# EAGLE schematic Pinscape Pico Expansion Board - DIY Friendly Power - SMD Sockets (EAGLE 7.7.0)

## Sheet 1 of 5: Picos
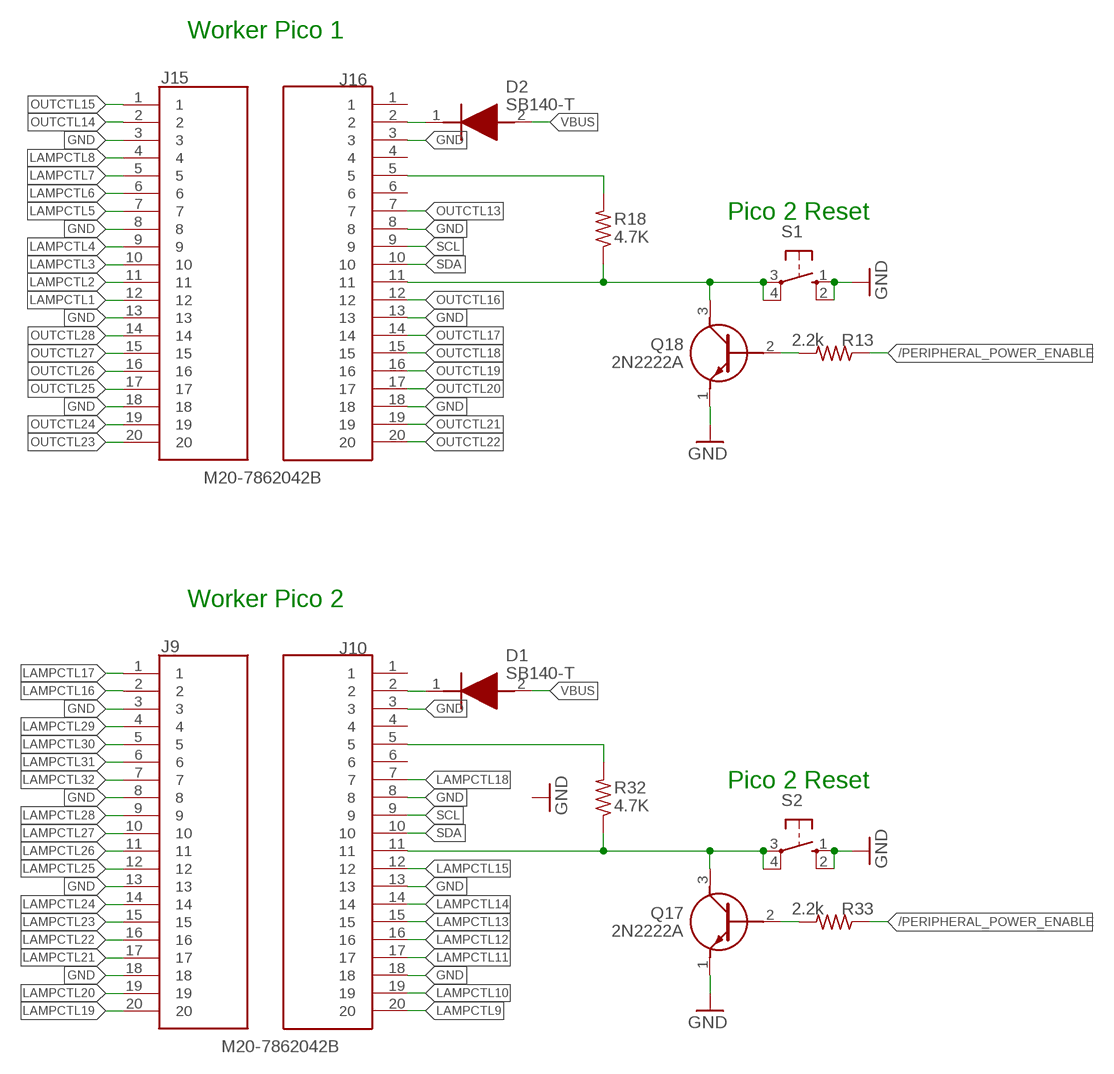
[diagram p0: schematic, sheet 1]

### Parts
D1  SB140-T  [DIOAD1408W86L464D236]
D2  SB140-T  [DIOAD1408W86L464D236]
J9  M20-7862042B  [M20-7862042-B]
J10  M20-7862042B  [M20-7862042-B]
J15  M20-7862042B  [M20-7862042-B]
J16  M20-7862042B  [M20-7862042-B]
Q17  2N2222A  [2N2222A]
Q18  2N2222A  [2N2222A]
R13  2.2k  R-US_0204/7  [0204/7]
R18  4.7K  R-US_0204/7  [0204/7]
R32  4.7K  R-US_0204/7  [0204/7]
R33  2.2k  R-US_0204/7  [0204/7]
S1  10-XX  [B3F-10XX]
S2  10-XX  [B3F-10XX]

### Nets
/PERIPHERAL_POWER_ENABLE: R13.1 R33.1 ; also sheet 2
GND: J9.3 J9.8 J9.13 J9.18 J10.3 J10.8 J10.13 J10.18 J15.3 J15.8 J15.13 J15.18 J16.3 J16.8 J16.13 J16.18 Q17.1(E) Q18.1(E) S1.1(S) S1.2(S1) S2.1(S) S2.2(S1) ; also sheet 2,3,4,5
LAMPCTL1: J15.12 ; also sheet 4
LAMPCTL2: J15.11 ; also sheet 4
LAMPCTL3: J15.10 ; also sheet 4
LAMPCTL4: J15.9 ; also sheet 4
LAMPCTL5: J15.7 ; also sheet 4
LAMPCTL6: J15.6 ; also sheet 4
LAMPCTL7: J15.5 ; also sheet 4
LAMPCTL8: J15.4 ; also sheet 4
LAMPCTL9: J10.20 ; also sheet 4
LAMPCTL10: J10.19 ; also sheet 4
LAMPCTL11: J10.17 ; also sheet 4
LAMPCTL12: J10.16 ; also sheet 4
LAMPCTL13: J10.15 ; also sheet 4
LAMPCTL14: J10.14 ; also sheet 4
LAMPCTL15: J10.12 ; also sheet 4
LAMPCTL16: J9.2 ; also sheet 4
LAMPCTL17: J9.1 ; also sheet 4
LAMPCTL18: J10.7 ; also sheet 4
LAMPCTL19: J9.20 ; also sheet 4
LAMPCTL20: J9.19 ; also sheet 4
LAMPCTL21: J9.17 ; also sheet 4
LAMPCTL22: J9.16 ; also sheet 4
LAMPCTL23: J9.15 ; also sheet 4
LAMPCTL24: J9.14 ; also sheet 4
LAMPCTL25: J9.12 ; also sheet 4
LAMPCTL26: J9.11 ; also sheet 4
LAMPCTL27: J9.10 ; also sheet 4
LAMPCTL28: J9.9 ; also sheet 4
LAMPCTL29: J9.4 ; also sheet 4
LAMPCTL30: J9.5 ; also sheet 4
LAMPCTL31: J9.6 ; also sheet 4
LAMPCTL32: J9.7 ; also sheet 4
N$17: D1.1(K) J10.2
N$18: D2.1(K) J16.2
N$38: J10.5 R32.2
N$39: Q17.2(B) R33.2
N$40: J10.11 Q17.3(C) R32.1 S2.3(P) S2.4(P1)
N$41: J16.5 R18.2
N$42: Q18.2(B) R13.2
N$51: J16.11 Q18.3(C) R18.1 S1.3(P) S1.4(P1)
OUTCTL13: J16.7 ; also sheet 3
OUTCTL14: J15.2 ; also sheet 3
OUTCTL15: J15.1 ; also sheet 3
OUTCTL16: J16.12 ; also sheet 3
OUTCTL17: J16.14 ; also sheet 3
OUTCTL18: J16.15 ; also sheet 3
OUTCTL19: J16.16 ; also sheet 3
OUTCTL20: J16.17 ; also sheet 3
OUTCTL21: J16.19 ; also sheet 3
OUTCTL22: J16.20 ; also sheet 3
OUTCTL23: J15.20 ; also sheet 3
OUTCTL24: J15.19 ; also sheet 3
OUTCTL25: J15.17 ; also sheet 3
OUTCTL26: J15.16 ; also sheet 3
OUTCTL27: J15.15 ; also sheet 3
OUTCTL28: J15.14 ; also sheet 3
SCL: J10.9 J16.9 ; also sheet 2,5
SDA: J10.10 J16.10 ; also sheet 2,5
VBUS: D1.2(A) D2.2(A) ; also sheet 2
Unconnected: J10.1 J10.4 J10.6 J16.1 J16.4 J16.6

### Notes on the sheet
- Worker Pico 1
- Pico 2 Reset
- Worker Pico 2
- Pico 2 Reset

## Sheet 2 of 5: Misc Ports
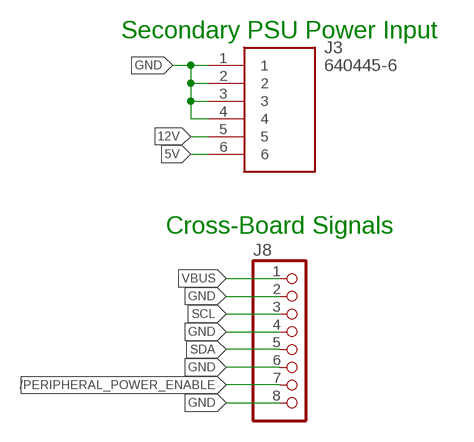
[diagram p1: schematic, sheet 2]

### Parts
J3  640445-6  [SHDR6W183P0X396_1X6_2377X762X1]
J8  PINHD-1X8/90  [1X08/90]

### Nets
5V: J3.6 ; also sheet 4,5
12V: J3.5 ; also sheet 3
/PERIPHERAL_POWER_ENABLE: J8.7 ; also sheet 1
GND: J3.1 J3.2 J3.3 J3.4 J8.2 J8.4 J8.6 J8.8 ; also sheet 1,3,4,5
SCL: J8.3 ; also sheet 1,5
SDA: J8.5 ; also sheet 1,5
VBUS: J8.1 ; also sheet 1

### Notes on the sheet
- Secondary PSU Power Input
- Cross-Board Signals

## Sheet 3 of 5: MOSFET Outputs
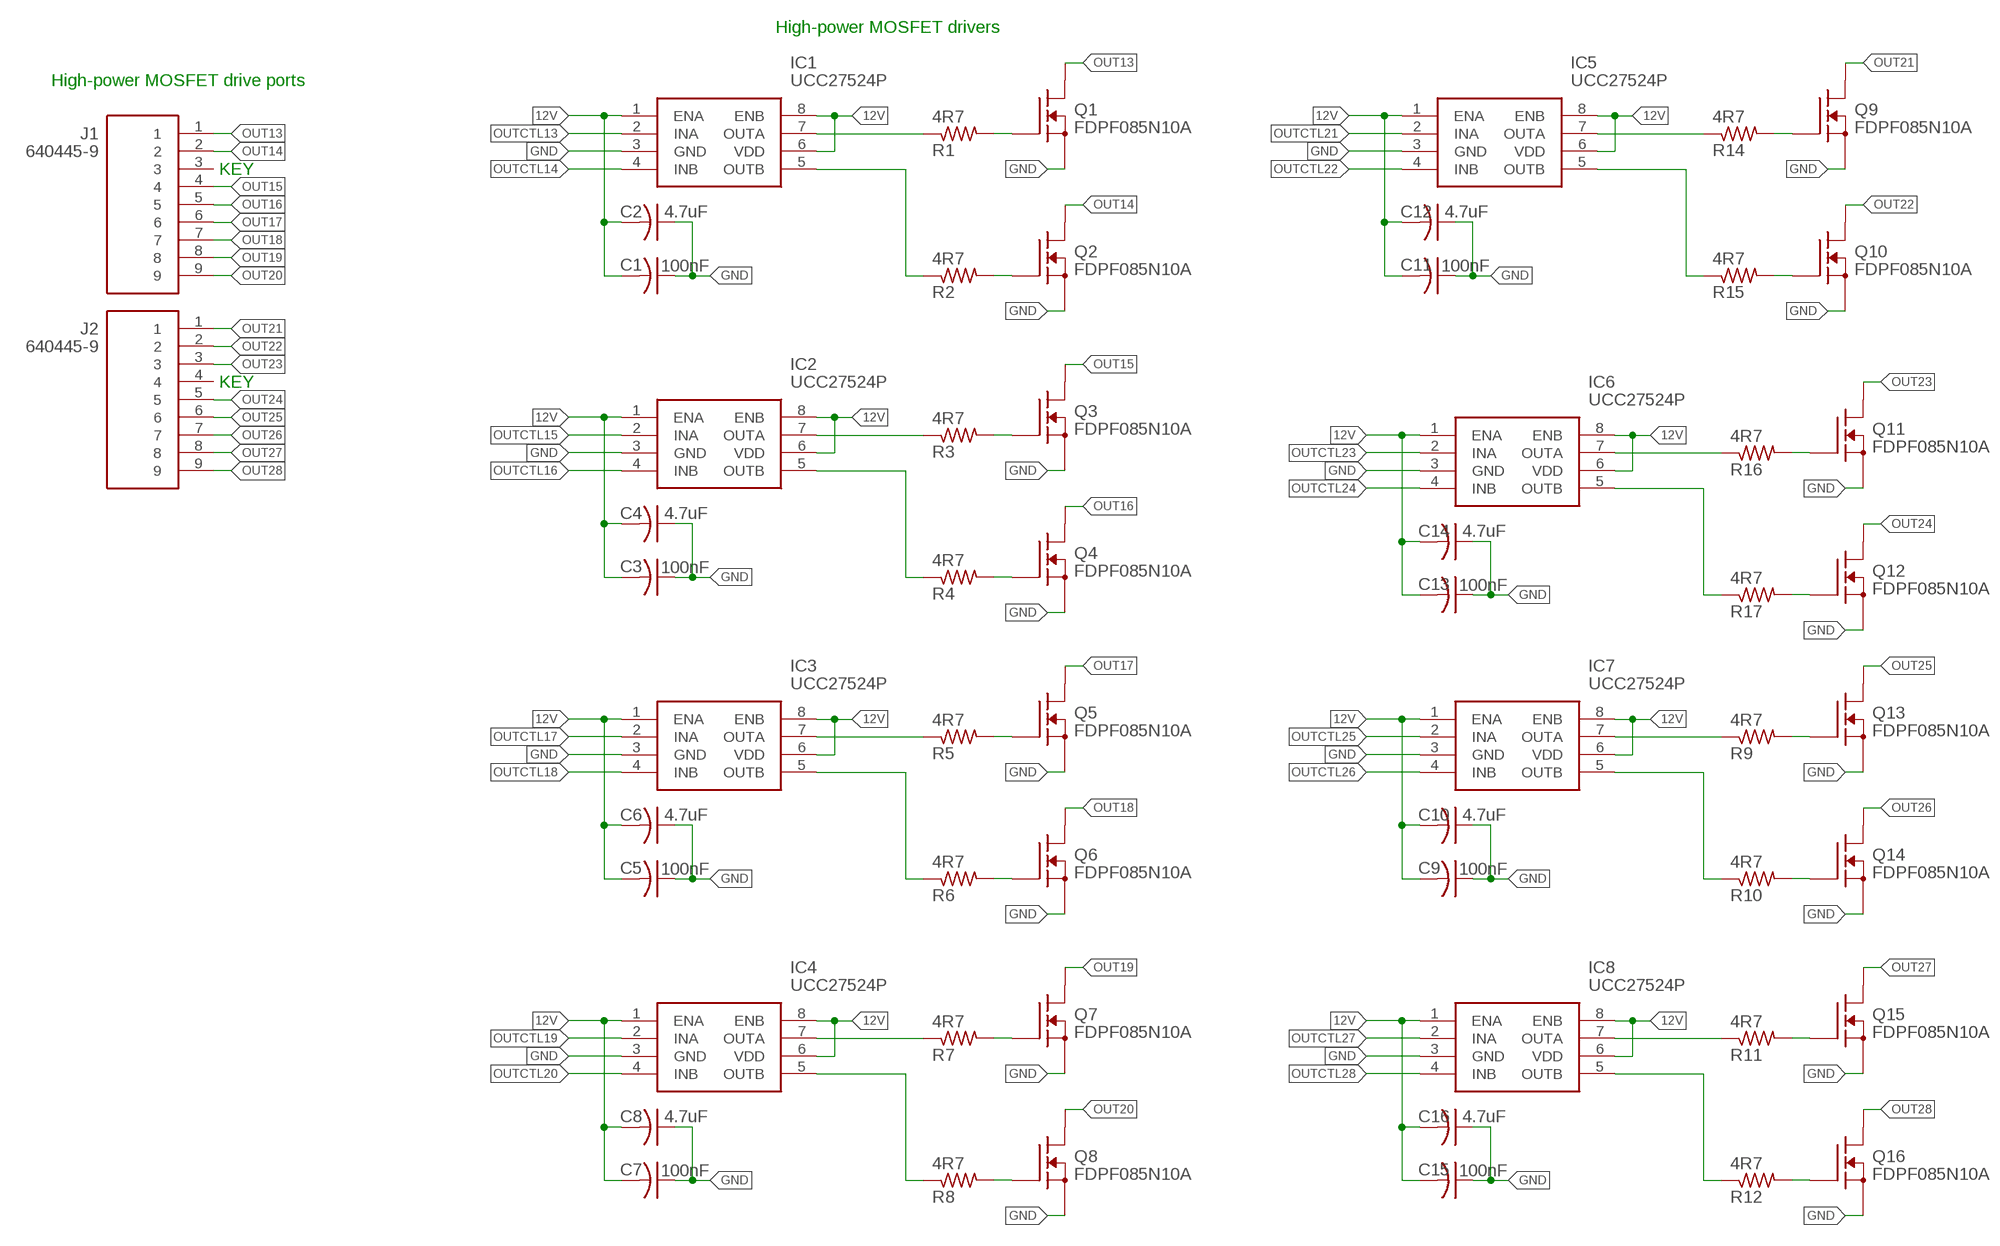
[diagram p2: schematic, sheet 3]

### Parts
C1  100nF  C-US025-024X044  [C025-024X044]
C2  4.7uF  C-US025-024X044  [C025-024X044]
C3  100nF  C-US025-024X044  [C025-024X044]
C4  4.7uF  C-US025-024X044  [C025-024X044]
C5  100nF  C-US025-024X044  [C025-024X044]
C6  4.7uF  C-US025-024X044  [C025-024X044]
C7  100nF  C-US025-024X044  [C025-024X044]
C8  4.7uF  C-US025-024X044  [C025-024X044]
C9  100nF  C-US025-024X044  [C025-024X044]
C10  4.7uF  C-US025-024X044  [C025-024X044]
C11  100nF  C-US025-024X044  [C025-024X044]
C12  4.7uF  C-US025-024X044  [C025-024X044]
C13  100nF  C-US025-024X044  [C025-024X044]
C14  4.7uF  C-US025-024X044  [C025-024X044]
C15  100nF  C-US025-024X044  [C025-024X044]
C16  4.7uF  C-US025-024X044  [C025-024X044]
IC1  UCC27524P  [DIP794W53P254L959H508Q8N]
IC2  UCC27524P  [DIP794W53P254L959H508Q8N]
IC3  UCC27524P  [DIP794W53P254L959H508Q8N]
IC4  UCC27524P  [DIP794W53P254L959H508Q8N]
IC5  UCC27524P  [DIP794W53P254L959H508Q8N]
IC6  UCC27524P  [DIP794W53P254L959H508Q8N]
IC7  UCC27524P  [DIP794W53P254L959H508Q8N]
IC8  UCC27524P  [DIP794W53P254L959H508Q8N]
J1  640445-9  [SHDR9W117P0X396_1X9_3566X762X1]
J2  640445-9  [SHDR9W117P0X396_1X9_3566X762X1]
Q1  FDPF085N10A  BUK7575-55A  [TO220BV]
Q2  FDPF085N10A  BUK7575-55A  [TO220BV]
Q3  FDPF085N10A  BUK7575-55A  [TO220BV]
Q4  FDPF085N10A  BUK7575-55A  [TO220BV]
Q5  FDPF085N10A  BUK7575-55A  [TO220BV]
Q6  FDPF085N10A  BUK7575-55A  [TO220BV]
Q7  FDPF085N10A  BUK7575-55A  [TO220BV]
Q8  FDPF085N10A  BUK7575-55A  [TO220BV]
Q9  FDPF085N10A  BUK7575-55A  [TO220BV]
Q10  FDPF085N10A  BUK7575-55A  [TO220BV]
Q11  FDPF085N10A  BUK7575-55A  [TO220BV]
Q12  FDPF085N10A  BUK7575-55A  [TO220BV]
Q13  FDPF085N10A  BUK7575-55A  [TO220BV]
Q14  FDPF085N10A  BUK7575-55A  [TO220BV]
Q15  FDPF085N10A  BUK7575-55A  [TO220BV]
Q16  FDPF085N10A  BUK7575-55A  [TO220BV]
R1  4R7  R-US_0204/5  [0204/5]
R2  4R7  R-US_0204/5  [0204/5]
R3  4R7  R-US_0204/5  [0204/5]
R4  4R7  R-US_0204/5  [0204/5]
R5  4R7  R-US_0204/5  [0204/5]
R6  4R7  R-US_0204/5  [0204/5]
R7  4R7  R-US_0204/5  [0204/5]
R8  4R7  R-US_0204/5  [0204/5]
R9  4R7  R-US_0204/5  [0204/5]
R10  4R7  R-US_0204/5  [0204/5]
R11  4R7  R-US_0204/5  [0204/5]
R12  4R7  R-US_0204/5  [0204/5]
R14  4R7  R-US_0204/5  [0204/5]
R15  4R7  R-US_0204/5  [0204/5]
R16  4R7  R-US_0204/5  [0204/5]
R17  4R7  R-US_0204/5  [0204/5]

### Nets
12V: C1.2 C2.2 C3.2 C4.2 C5.2 C6.2 C7.2 C8.2 C9.2 C10.2 C11.2 C12.2 C13.2 C14.2 C15.2 C16.2 IC1.1(ENA) IC1.6(VDD) IC1.8(ENB) IC2.1(ENA) IC2.6(VDD) IC2.8(ENB) IC3.1(ENA) IC3.6(VDD) IC3.8(ENB) IC4.1(ENA) IC4.6(VDD) IC4.8(ENB) IC5.1(ENA) IC5.6(VDD) IC5.8(ENB) IC6.1(ENA) IC6.6(VDD) IC6.8(ENB) IC7.1(ENA) IC7.6(VDD) IC7.8(ENB) IC8.1(ENA) IC8.6(VDD) IC8.8(ENB) ; also sheet 2
GND: C1.1 C2.1 C3.1 C4.1 C5.1 C6.1 C7.1 C8.1 C9.1 C10.1 C11.1 C12.1 C13.1 C14.1 C15.1 C16.1 IC1.3(GND) IC2.3(GND) IC3.3(GND) IC4.3(GND) IC5.3(GND) IC6.3(GND) IC7.3(GND) IC8.3(GND) Q1.3(S) Q2.3(S) Q3.3(S) Q4.3(S) Q5.3(S) Q6.3(S) Q7.3(S) Q8.3(S) Q9.3(S) Q10.3(S) Q11.3(S) Q12.3(S) Q13.3(S) Q14.3(S) Q15.3(S) Q16.3(S) ; also sheet 1,2,4,5
N$1: IC1.7(OUTA) R1.1
N$2: IC1.5(OUTB) R2.1
N$3: Q1.1(G) R1.2
N$4: Q2.1(G) R2.2
N$5: IC2.7(OUTA) R3.1
N$6: IC2.5(OUTB) R4.1
N$7: Q3.1(G) R3.2
N$8: Q4.1(G) R4.2
N$9: IC3.7(OUTA) R5.1
N$10: IC3.5(OUTB) R6.1
N$11: Q5.1(G) R5.2
N$12: Q6.1(G) R6.2
N$13: IC4.7(OUTA) R7.1
N$14: IC4.5(OUTB) R8.1
N$15: Q7.1(G) R7.2
N$16: Q8.1(G) R8.2
N$19: IC5.7(OUTA) R14.1
N$20: IC5.5(OUTB) R15.1
N$21: IC7.7(OUTA) R9.1
N$22: IC7.5(OUTB) R10.1
N$23: Q13.1(G) R9.2
N$24: Q14.1(G) R10.2
N$25: Q9.1(G) R14.2
N$26: Q10.1(G) R15.2
N$27: IC6.7(OUTA) R16.1
N$28: IC6.5(OUTB) R17.1
N$29: Q11.1(G) R16.2
N$30: Q12.1(G) R17.2
N$31: IC8.7(OUTA) R11.1
N$32: IC8.5(OUTB) R12.1
N$33: Q15.1(G) R11.2
N$34: Q16.1(G) R12.2
OUT13: J1.1 Q1.2(D)
OUT14: J1.2 Q2.2(D)
OUT15: J1.4 Q3.2(D)
OUT16: J1.5 Q4.2(D)
OUT17: J1.6 Q5.2(D)
OUT18: J1.7 Q6.2(D)
OUT19: J1.8 Q7.2(D)
OUT20: J1.9 Q8.2(D)
OUT21: J2.1 Q9.2(D)
OUT22: J2.2 Q10.2(D)
OUT23: J2.3 Q11.2(D)
OUT24: J2.5 Q12.2(D)
OUT25: J2.6 Q13.2(D)
OUT26: J2.7 Q14.2(D)
OUT27: J2.8 Q15.2(D)
OUT28: J2.9 Q16.2(D)
OUTCTL13: IC1.2(INA) ; also sheet 1
OUTCTL14: IC1.4(INB) ; also sheet 1
OUTCTL15: IC2.2(INA) ; also sheet 1
OUTCTL16: IC2.4(INB) ; also sheet 1
OUTCTL17: IC3.2(INA) ; also sheet 1
OUTCTL18: IC3.4(INB) ; also sheet 1
OUTCTL19: IC4.2(INA) ; also sheet 1
OUTCTL20: IC4.4(INB) ; also sheet 1
OUTCTL21: IC5.2(INA) ; also sheet 1
OUTCTL22: IC5.4(INB) ; also sheet 1
OUTCTL23: IC6.2(INA) ; also sheet 1
OUTCTL24: IC6.4(INB) ; also sheet 1
OUTCTL25: IC7.2(INA) ; also sheet 1
OUTCTL26: IC7.4(INB) ; also sheet 1
OUTCTL27: IC8.2(INA) ; also sheet 1
OUTCTL28: IC8.4(INB) ; also sheet 1
Unconnected: J1.3 J2.4

### Notes on the sheet
- High-power MOSFET drivers
- High-power MOSFET drive ports
- KEY
- KEY

## Sheet 4 of 5: Lamp Outputs
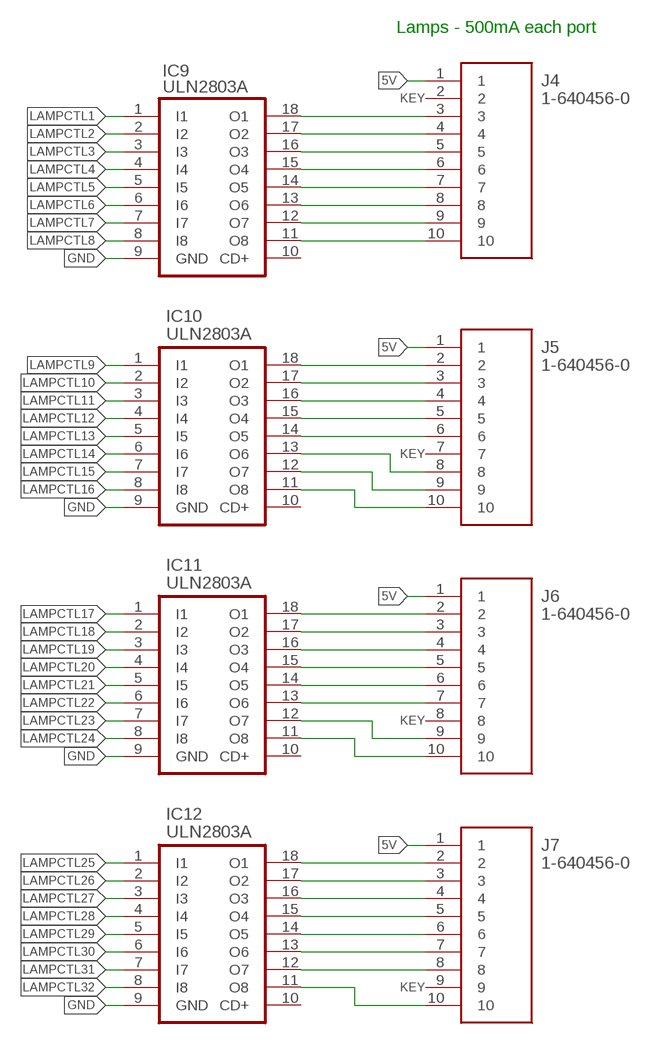
[diagram p3: schematic, sheet 4]

### Parts
IC9  ULN2803A  [DIL18]
IC10  ULN2803A  [DIL18]
IC11  ULN2803A  [DIL18]
IC12  ULN2803A  [DIL18]
J4  1-640456-0  [SHDR10W66P0X254_1X10_2540X572X]
J5  1-640456-0  [SHDR10W66P0X254_1X10_2540X572X]
J6  1-640456-0  [SHDR10W66P0X254_1X10_2540X572X]
J7  1-640456-0  [SHDR10W66P0X254_1X10_2540X572X]

### Nets
5V: J4.1 J5.1 J6.1 J7.1 ; also sheet 2,5
GND: IC9.9(GND) IC10.9(GND) IC11.9(GND) IC12.9(GND) ; also sheet 1,2,3,5
LAMPCTL1: IC9.1(I1) ; also sheet 1
LAMPCTL2: IC9.2(I2) ; also sheet 1
LAMPCTL3: IC9.3(I3) ; also sheet 1
LAMPCTL4: IC9.4(I4) ; also sheet 1
LAMPCTL5: IC9.5(I5) ; also sheet 1
LAMPCTL6: IC9.6(I6) ; also sheet 1
LAMPCTL7: IC9.7(I7) ; also sheet 1
LAMPCTL8: IC9.8(I8) ; also sheet 1
LAMPCTL9: IC10.1(I1) ; also sheet 1
LAMPCTL10: IC10.2(I2) ; also sheet 1
LAMPCTL11: IC10.3(I3) ; also sheet 1
LAMPCTL12: IC10.4(I4) ; also sheet 1
LAMPCTL13: IC10.5(I5) ; also sheet 1
LAMPCTL14: IC10.6(I6) ; also sheet 1
LAMPCTL15: IC10.7(I7) ; also sheet 1
LAMPCTL16: IC10.8(I8) ; also sheet 1
LAMPCTL17: IC11.1(I1) ; also sheet 1
LAMPCTL18: IC11.2(I2) ; also sheet 1
LAMPCTL19: IC11.3(I3) ; also sheet 1
LAMPCTL20: IC11.4(I4) ; also sheet 1
LAMPCTL21: IC11.5(I5) ; also sheet 1
LAMPCTL22: IC11.6(I6) ; also sheet 1
LAMPCTL23: IC11.7(I7) ; also sheet 1
LAMPCTL24: IC11.8(I8) ; also sheet 1
LAMPCTL25: IC12.1(I1) ; also sheet 1
LAMPCTL26: IC12.2(I2) ; also sheet 1
LAMPCTL27: IC12.3(I3) ; also sheet 1
LAMPCTL28: IC12.4(I4) ; also sheet 1
LAMPCTL29: IC12.5(I5) ; also sheet 1
LAMPCTL30: IC12.6(I6) ; also sheet 1
LAMPCTL31: IC12.7(I7) ; also sheet 1
LAMPCTL32: IC12.8(I8) ; also sheet 1
N$43: IC12.18(O1) J7.2
N$44: IC12.17(O2) J7.3
N$45: IC12.16(O3) J7.4
N$46: IC12.15(O4) J7.5
N$47: IC12.14(O5) J7.6
N$48: IC12.13(O6) J7.7
N$49: IC12.12(O7) J7.8
N$50: IC12.11(O8) J7.10
N$59: IC11.18(O1) J6.2
N$60: IC11.17(O2) J6.3
N$61: IC11.16(O3) J6.4
N$62: IC11.15(O4) J6.5
N$63: IC11.14(O5) J6.6
N$64: IC11.13(O6) J6.7
N$65: IC11.12(O7) J6.9
N$66: IC11.11(O8) J6.10
N$67: IC9.18(O1) J4.3
N$68: IC9.17(O2) J4.4
N$69: IC9.16(O3) J4.5
N$70: IC9.15(O4) J4.6
N$71: IC9.14(O5) J4.7
N$72: IC9.13(O6) J4.8
N$73: IC9.12(O7) J4.9
N$74: IC9.11(O8) J4.10
N$75: IC10.18(O1) J5.2
N$76: IC10.17(O2) J5.3
N$77: IC10.16(O3) J5.4
N$78: IC10.15(O4) J5.5
N$79: IC10.14(O5) J5.6
N$80: IC10.13(O6) J5.8
N$81: IC10.12(O7) J5.9
N$82: IC10.11(O8) J5.10
Unconnected: IC9.10(CD+) IC10.10(CD+) IC11.10(CD+) IC12.10(CD+) J4.2 J5.7 J6.8 J7.9

### Notes on the sheet
- Lamps - 500mA each port
- KEY
- KEY
- KEY
- KEY

## Sheet 5 of 5: Real-Time Clock
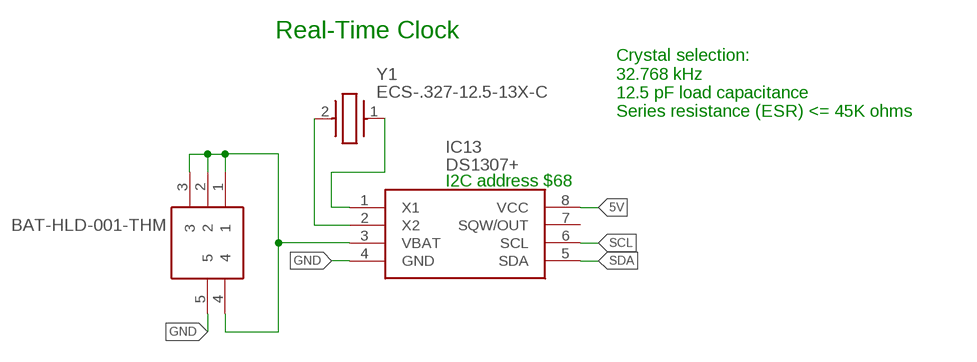
[diagram p4: schematic, sheet 5]

### Parts
BATT1  BAT-HLD-001-THM  [BATHLD001THM]
IC13  DS1307+  [DIP794W56P254L938H457Q8N]
Y1  ECS-.327-12.5-13X-C  [ECS32712513XC]

### Nets
5V: IC13.8(VCC) ; also sheet 2,4
GND: BATT1.5 IC13.4(GND) ; also sheet 1,2,3,4
N$35: BATT1.1 BATT1.2 BATT1.3 BATT1.4 IC13.3(VBAT)
N$36: IC13.1(X1) Y1.1(CRYSTAL_1)
N$37: IC13.2(X2) Y1.2(CRYSTAL_2)
SCL: IC13.6(SCL) ; also sheet 1,2
SDA: IC13.5(SDA) ; also sheet 1,2
Unconnected: IC13.7(SQW/OUT)

### Notes on the sheet
- Real-Time Clock
- Crystal selection:
  32.768 kHz
  12.5 pF load capacitance
  Series resistance (ESR) <= 45K ohms
- I2C address $68

## Library data of the parts
BATT1 = SamacSys_Parts:BAT-HLD-001-THM: Coin Cell Battery Holders Bat Hld CR2032/2025 Through-hole Mount Source: Datasheet <https://componentsearchengine.com/Datasheets/1/BAT-HLD-001-THM.pdf>; DESCRIPTION: Coin Cell Battery Holders Bat Hld CR2032/2025 Through-hole Mount; HEIGHT: 4.2mm; MANUFACTURER_NAME: Linx Technologies; MANUFACTURER_PART_NUMBER: BAT-HLD-001-THM; MOUSER_PART_NUMBER: 712-BAT-HLD-001-THM; MOUSER_PRICE-STOCK: https://www.mouser.com/Search/Refine.aspx?Keyword=712-BAT-HLD-001-THM
C1 C3 C5 C7 C9 C11 C13 C15 = rcl:C-US: CAPACITOR, American symbol; PARTNO: 21RZ310-RC
C2 C4 C6 C8 C10 C12 C14 C16 = rcl:C-US: CAPACITOR, American symbol; PARTNO: 810-FG14X5R1H475KRT0
D1 D2 = SamacSys_Parts:SB140-T: Schottky Diodes & Rectifiers 1.0A 40V Source: Datasheet <https://www.arrow.com/en/products/sb140-t/diodes-incorporated>; DESCRIPTION: Schottky Diodes & Rectifiers 1.0A 40V; HEIGHT: mm; MANUFACTURER_NAME: Diodes Incorporated; MANUFACTURER_PART_NUMBER: SB140-T; MOUSER_PART_NUMBER: 621-SB140-T; MOUSER_PRICE-STOCK: https://www.mouser.co.uk/ProductDetail/Diodes-Incorporated/SB140-T?qs=sxN%252BoM2fis8H2rSIUCd%252Bfg%3D%3D
IC1-IC8 = SamacSys_Parts:UCC27524P: Dual, 5A, High-Speed Low-Side Power MOSFET Driver Source: Datasheet <http://www.ti.com/lit/gpn/ucc27524>; DESCRIPTION: Dual, 5A, High-Speed Low-Side Power MOSFET Driver; HEIGHT: 5.08mm; MANUFACTURER_NAME: Texas Instruments; MANUFACTURER_PART_NUMBER: UCC27524P; MOUSER_PART_NUMBER: 595-UCC27524P; MOUSER_PRICE-STOCK: https://www.mouser.co.uk/ProductDetail/Texas-Instruments/UCC27524P?qs=iuXUNOC6nYeLYu3RiGlNsQ%3D%3D
IC9-IC12 = uln-udn:ULN2803A: DRIVER ARRAY
IC13 = SamacSys_Parts:DS1307+: Real time clock,DS1307 56B RAM DIP8 Maxim DS1307+ Real Time Clock, Alarm, Calendar, Clock, 56B RAM, I2C, 5.5 V, 8-Pin PDIP Source: Datasheet <http://datasheets.maximintegrated.com/en/ds/DS1307.pdf>; DESCRIPTION: Real time clock,DS1307 56B RAM DIP8 Maxim DS1307+ Real Time Clock, Alarm, Calendar, Clock, 56B RAM, I2C, 5.5 V, 8-Pin PDIP; HEIGHT: 4.572mm; MANUFACTURER_NAME: Analog Devices; MANUFACTURER_PART_NUMBER: DS1307+; MOUSER_PART_NUMBER: 700-DS1307; MOUSER_PRICE-STOCK: https://www.mouser.co.uk/ProductDetail/Analog-Devices-Maxim-Integrated/DS1307%2b?qs=0Y9aZN%252BMVCVfCMpmynAtEg%3D%3D
J1 J2 = SamacSys_Parts:640445-9: Header,MTA156,straight,3.96mm,9way Source: Datasheet <https://www.te.com/commerce/DocumentDelivery/DDEController?Action=srchrtrv&DocNm=82056_MTA&DocType=Data Sheet&DocLang=English&PartCntxt=640445-9&DocFormat=pdf>; DESCRIPTION: Header,MTA156,straight,3.96mm,9way; HEIGHT: 13.716mm; MANUFACTURER_NAME: TE Connectivity; MANUFACTURER_PART_NUMBER: 640445-9; MOUSER_PART_NUMBER: 571-6404459; MOUSER_PRICE-STOCK: https://www.mouser.co.uk/ProductDetail/TE-Connectivity/640445-9?qs=P8zzrVhehauUywCYO3wBKg%3D%3D
J3 = SamacSys_Parts:640445-6: 6 way friction lock header,3.96mm pitch Source: Datasheet <https://componentsearchengine.com/Datasheets/1/640445-6.pdf>; DESCRIPTION: 6 way friction lock header,3.96mm pitch; HEIGHT: 11.049mm; MANUFACTURER_NAME: TE Connectivity; MANUFACTURER_PART_NUMBER: 640445-6; MOUSER_PART_NUMBER: 571-6404456; MOUSER_PRICE-STOCK: https://www.mouser.com/Search/Refine.aspx?Keyword=571-6404456
J4-J7 = SamacSys_Parts:1-640456-0: 10 way MTA straight friction lock header Source: Datasheet <https://datasheet.datasheetarchive.com/originals/distributors/Datasheets_SAMA/53b6d75d7446c4158b7609f45acef8cd.pdf>; DESCRIPTION: 10 way MTA straight friction lock header; HEIGHT: 10.414mm; MANUFACTURER_NAME: TE Connectivity; MANUFACTURER_PART_NUMBER: 1-640456-0; MOUSER_PART_NUMBER: 571-16404560; MOUSER_PRICE-STOCK: https://www.mouser.co.uk/ProductDetail/TE-Connectivity-AMP/1-640456-0?qs=%2F35zJ5USjomFMMbv03PGrg%3D%3D
J8 = pinhead:PINHD-1X8: PIN HEADER
J9 J10 J15 J16 = SamacSys_Parts:M20-7862042: 2.54mm (0.1") Pitch SIL SMT Dual Entry Socket Assembly, selective gold + tin, 20 contacts Source: Datasheet <https://cdn.harwin.com/pdfs/M20-786.pdf>
Q1-Q16 = BUK7575:BUK7575-55A; PARTNO: FDPF085N10A
Q17 Q18 = SamacSys_Parts:2N2222A: NPN General purpose transistor . IC 150 mA . f 100 MHz Source: Datasheet <https://diotec.com/request/datasheet/2n2222a.pdf>; DESCRIPTION: NPN General purpose transistor . IC 150 mA . f 100 MHz; HEIGHT: 7.5mm; MANUFACTURER_NAME: Diotec; MANUFACTURER_PART_NUMBER: 2N2222A; MOUSER_PART_NUMBER: 637-2N2222A; MOUSER_PRICE-STOCK: https://www.mouser.co.uk/ProductDetail/Diotec-Semiconductor/2N2222A?qs=OlC7AqGiEDmNlRSTGL2dYg%3D%3D
R1-R18 R32 R33 = resistor:R-US_: RESISTOR, American symbol; PARTNO: 660-MFS1/4DCT52R47R0
S1 S2 = switch-omron:10-XX: OMRON SWITCH; MPN: B3F-1000; OC_FARNELL: 176432; OC_NEWARK: 36M3542
Y1 = SamacSys_Parts:ECS-.327-12.5-13X-C: Crystals CRYSTAL 32.768 kHZ 12.5 PF SMD, ESR 35K Ohms, +/-10ppm -20 C 70 C, 2.1 x 6.2 1 uw Max +/- 3 ppm 1st Year Aging Max Source: Datasheet; DESCRIPTION: Crystals CRYSTAL 32.768 kHZ 12.5 PF SMD, ESR 35K Ohms, +/-10ppm -20 C 70 C, 2.1 x 6.2 1 uw Max +/- 3 ppm 1st Year Aging Max; HEIGHT: 6.2mm; MANUFACTURER_NAME: ECS; MANUFACTURER_PART_NUMBER: ECS-.327-12.5-13X-C; MOUSER_PART_NUMBER: 520-S-.32712.513XC; MOUSER_PRICE-STOCK: https://www.mouser.co.uk/ProductDetail/ECS/ECS-.327-12.5-13X-C?qs=zW32dvEIR3sSXlfaut3cdQ%3D%3D